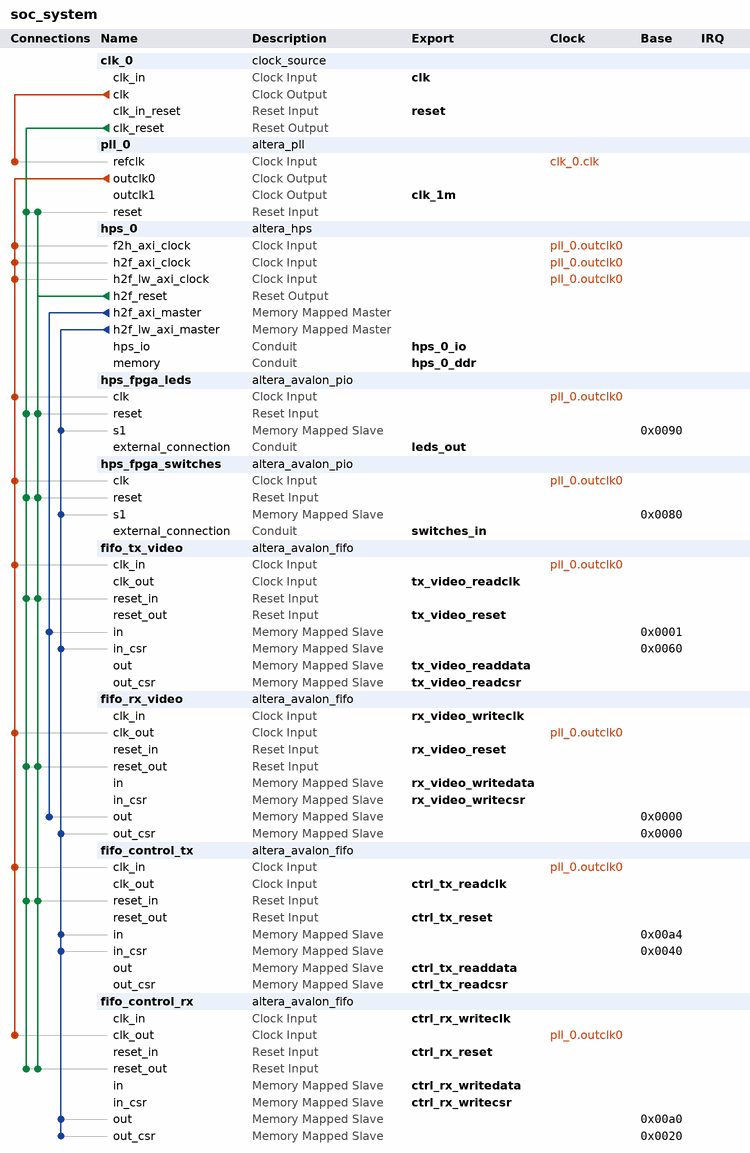
[diagram p0: system contents]
# Platform Designer (Qsys) system soc_system, Cyclone V 5CSEMA5F31C6
# Parameters at their usual value, and those the tool derives, are not listed.
package require -exact qsys 18.1
create_system soc_system
set_project_property DEVICE_FAMILY {Cyclone V}
set_project_property DEVICE 5CSEMA5F31C6

add_instance clk_0 clock_source 18.1
set_instance_parameter_value clk_0 clockFrequency 50000000

add_instance pll_0 altera_pll 18.1
set_instance_parameter_value pll_0 gui_device_speed_grade 2
set_instance_parameter_value pll_0 gui_number_of_clocks 2
set_instance_parameter_value pll_0 gui_operation_mode normal
set_instance_parameter_value pll_0 gui_output_clock_frequency0 50.0
set_instance_parameter_value pll_0 gui_output_clock_frequency1 10.0
set_instance_parameter_value pll_0 gui_pll_mode {Integer-N PLL}
set_instance_parameter_value pll_0 gui_reference_clock_frequency 50.0
set_instance_parameter_value pll_0 gui_use_locked false

add_instance hps_0 altera_hps 18.1
set_instance_parameter_value hps_0 EMAC1_Mode RGMII
set_instance_parameter_value hps_0 EMAC1_PinMuxing {HPS I/O Set 0}
set_instance_parameter_value hps_0 F2SCLK_COLDRST_Enable false
set_instance_parameter_value hps_0 F2SCLK_DBGRST_Enable false
set_instance_parameter_value hps_0 F2SCLK_WARMRST_Enable false
set_instance_parameter_value hps_0 F2SINTERRUPT_Enable false
set_instance_parameter_value hps_0 F2S_Width 2
set_instance_parameter_value hps_0 FPGA_PERIPHERAL_OUTPUT_CLOCK_FREQ_EMAC0_GTX_CLK 125
set_instance_parameter_value hps_0 FPGA_PERIPHERAL_OUTPUT_CLOCK_FREQ_EMAC0_MD_CLK 100.0
set_instance_parameter_value hps_0 FPGA_PERIPHERAL_OUTPUT_CLOCK_FREQ_EMAC1_GTX_CLK 125
set_instance_parameter_value hps_0 FPGA_PERIPHERAL_OUTPUT_CLOCK_FREQ_EMAC1_MD_CLK 100.0
set_instance_parameter_value hps_0 HPS_PROTOCOL DDR3
set_instance_parameter_value hps_0 I2C0_Mode I2C
set_instance_parameter_value hps_0 I2C0_PinMuxing {HPS I/O Set 0}
set_instance_parameter_value hps_0 I2C1_Mode I2C
set_instance_parameter_value hps_0 I2C1_PinMuxing {HPS I/O Set 0}
set_instance_parameter_value hps_0 LWH2F_Enable true
set_instance_parameter_value hps_0 MEM_BANKADDR_WIDTH 3
set_instance_parameter_value hps_0 MEM_CLK_FREQ 400.0
set_instance_parameter_value hps_0 MEM_COL_ADDR_WIDTH 10
set_instance_parameter_value hps_0 MEM_DQ_WIDTH 32
set_instance_parameter_value hps_0 MEM_DRV_STR RZQ/7
set_instance_parameter_value hps_0 MEM_ROW_ADDR_WIDTH 15
set_instance_parameter_value hps_0 MEM_RTT_NOM RZQ/4
set_instance_parameter_value hps_0 MEM_RTT_WR RZQ/4
set_instance_parameter_value hps_0 MEM_TCL 11
set_instance_parameter_value hps_0 MEM_TFAW_NS 30.0
set_instance_parameter_value hps_0 MEM_TRAS_NS 35.0
set_instance_parameter_value hps_0 MEM_TRCD_NS 13.75
set_instance_parameter_value hps_0 MEM_TRFC_NS 260.0
set_instance_parameter_value hps_0 MEM_TRP_NS 13.75
set_instance_parameter_value hps_0 MEM_VENDOR Other
set_instance_parameter_value hps_0 MEM_WTCL 8
set_instance_parameter_value hps_0 QSPI_Mode {1 SS}
set_instance_parameter_value hps_0 QSPI_PinMuxing {HPS I/O Set 0}
set_instance_parameter_value hps_0 REF_CLK_FREQ 25.0
set_instance_parameter_value hps_0 S2FCLK_USER2CLK 5
set_instance_parameter_value hps_0 S2F_Width 2
set_instance_parameter_value hps_0 SDIO_Mode {4-bit Data}
set_instance_parameter_value hps_0 SDIO_PinMuxing {HPS I/O Set 0}
set_instance_parameter_value hps_0 SPIM1_Mode {Single Slave Select}
set_instance_parameter_value hps_0 SPIM1_PinMuxing {HPS I/O Set 0}
set_instance_parameter_value hps_0 STM_Enable false
set_instance_parameter_value hps_0 TIMING_BOARD_AC_SKEW 0.02
set_instance_parameter_value hps_0 TIMING_BOARD_AC_TO_CK_SKEW 0.01
set_instance_parameter_value hps_0 TIMING_BOARD_DQ_TO_DQS_SKEW 0.05
set_instance_parameter_value hps_0 TIMING_BOARD_MAX_CK_DELAY 0.03
set_instance_parameter_value hps_0 TIMING_BOARD_MAX_DQS_DELAY 0.02
set_instance_parameter_value hps_0 TIMING_BOARD_SKEW_BETWEEN_DQS 0.06
set_instance_parameter_value hps_0 TIMING_BOARD_SKEW_CKDQS_DIMM_MAX 0.16
set_instance_parameter_value hps_0 TIMING_BOARD_SKEW_CKDQS_DIMM_MIN 0.06
set_instance_parameter_value hps_0 TIMING_BOARD_SKEW_WITHIN_DQS 0.01
set_instance_parameter_value hps_0 TIMING_TDH 65
set_instance_parameter_value hps_0 TIMING_TDQSCK 255
set_instance_parameter_value hps_0 TIMING_TDQSQ 125
set_instance_parameter_value hps_0 TIMING_TDS 30
set_instance_parameter_value hps_0 TIMING_TIH 140
set_instance_parameter_value hps_0 TIMING_TIS 180
set_instance_parameter_value hps_0 TIMING_TQSH 0.4
set_instance_parameter_value hps_0 UART0_Mode {No Flow Control}
set_instance_parameter_value hps_0 UART0_PinMuxing {HPS I/O Set 0}
set_instance_parameter_value hps_0 USB1_Mode SDR
set_instance_parameter_value hps_0 USB1_PinMuxing {HPS I/O Set 0}
set_instance_parameter_value hps_0 desired_cfg_clk_mhz 100.0
set_instance_parameter_value hps_0 desired_qspi_clk_mhz 400.0

add_instance hps_fpga_leds altera_avalon_pio 18.1
set_instance_parameter_value hps_fpga_leds direction Output
set_instance_parameter_value hps_fpga_leds width 10

add_instance hps_fpga_switches altera_avalon_pio 18.1
set_instance_parameter_value hps_fpga_switches direction Input
set_instance_parameter_value hps_fpga_switches width 10

add_instance fifo_tx_video altera_avalon_fifo 18.1
set_instance_parameter_value fifo_tx_video avalonMMAvalonMMDataWidth 8
set_instance_parameter_value fifo_tx_video bitsPerSymbol 16
set_instance_parameter_value fifo_tx_video channelWidth 8
set_instance_parameter_value fifo_tx_video errorWidth 8
set_instance_parameter_value fifo_tx_video fifoDepth 2048
set_instance_parameter_value fifo_tx_video fifoInputInterfaceOptions AVALONMM_WRITE
set_instance_parameter_value fifo_tx_video fifoOutputInterfaceOptions AVALONMM_READ
set_instance_parameter_value fifo_tx_video singleClockMode false
set_instance_parameter_value fifo_tx_video symbolsPerBeat 2
set_instance_parameter_value fifo_tx_video useBackpressure false
set_instance_parameter_value fifo_tx_video useIRQ false
set_instance_parameter_value fifo_tx_video usePacket true
set_instance_parameter_value fifo_tx_video useReadControl true

add_instance fifo_rx_video altera_avalon_fifo 18.1
set_instance_parameter_value fifo_rx_video avalonMMAvalonMMDataWidth 8
set_instance_parameter_value fifo_rx_video bitsPerSymbol 16
set_instance_parameter_value fifo_rx_video channelWidth 8
set_instance_parameter_value fifo_rx_video errorWidth 8
set_instance_parameter_value fifo_rx_video fifoDepth 2048
set_instance_parameter_value fifo_rx_video fifoInputInterfaceOptions AVALONMM_WRITE
set_instance_parameter_value fifo_rx_video fifoOutputInterfaceOptions AVALONMM_READ
set_instance_parameter_value fifo_rx_video singleClockMode false
set_instance_parameter_value fifo_rx_video symbolsPerBeat 2
set_instance_parameter_value fifo_rx_video useBackpressure false
set_instance_parameter_value fifo_rx_video useIRQ false
set_instance_parameter_value fifo_rx_video usePacket true
set_instance_parameter_value fifo_rx_video useReadControl true

add_instance fifo_control_tx altera_avalon_fifo 18.1
set_instance_parameter_value fifo_control_tx avalonMMAvalonMMDataWidth 8
set_instance_parameter_value fifo_control_tx bitsPerSymbol 16
set_instance_parameter_value fifo_control_tx channelWidth 8
set_instance_parameter_value fifo_control_tx errorWidth 8
set_instance_parameter_value fifo_control_tx fifoDepth 8
set_instance_parameter_value fifo_control_tx fifoInputInterfaceOptions AVALONMM_WRITE
set_instance_parameter_value fifo_control_tx fifoOutputInterfaceOptions AVALONMM_READ
set_instance_parameter_value fifo_control_tx singleClockMode false
set_instance_parameter_value fifo_control_tx symbolsPerBeat 2
set_instance_parameter_value fifo_control_tx useBackpressure false
set_instance_parameter_value fifo_control_tx useIRQ false
set_instance_parameter_value fifo_control_tx usePacket true
set_instance_parameter_value fifo_control_tx useReadControl true

add_instance fifo_control_rx altera_avalon_fifo 18.1
set_instance_parameter_value fifo_control_rx bitsPerSymbol 16
set_instance_parameter_value fifo_control_rx channelWidth 8
set_instance_parameter_value fifo_control_rx errorWidth 8
set_instance_parameter_value fifo_control_rx fifoDepth 8
set_instance_parameter_value fifo_control_rx fifoInputInterfaceOptions AVALONMM_WRITE
set_instance_parameter_value fifo_control_rx fifoOutputInterfaceOptions AVALONMM_READ
set_instance_parameter_value fifo_control_rx singleClockMode false
set_instance_parameter_value fifo_control_rx symbolsPerBeat 2
set_instance_parameter_value fifo_control_rx useBackpressure false
set_instance_parameter_value fifo_control_rx useIRQ false
set_instance_parameter_value fifo_control_rx usePacket true
set_instance_parameter_value fifo_control_rx useReadControl true

# connections
add_connection clk_0.clk pll_0.refclk clock
add_connection pll_0.outclk0 fifo_control_rx.clk_out clock
add_connection pll_0.outclk0 fifo_control_tx.clk_in clock
add_connection pll_0.outclk0 fifo_rx_video.clk_out clock
add_connection pll_0.outclk0 fifo_tx_video.clk_in clock
add_connection pll_0.outclk0 hps_0.f2h_axi_clock clock
add_connection pll_0.outclk0 hps_0.h2f_axi_clock clock
add_connection pll_0.outclk0 hps_0.h2f_lw_axi_clock clock
add_connection pll_0.outclk0 hps_fpga_leds.clk clock
add_connection pll_0.outclk0 hps_fpga_switches.clk clock
add_connection clk_0.clk_reset fifo_control_rx.reset_out reset
add_connection clk_0.clk_reset fifo_control_tx.reset_in reset
add_connection clk_0.clk_reset fifo_rx_video.reset_out reset
add_connection clk_0.clk_reset fifo_tx_video.reset_in reset
add_connection clk_0.clk_reset hps_fpga_leds.reset reset
add_connection clk_0.clk_reset hps_fpga_switches.reset reset
add_connection clk_0.clk_reset pll_0.reset reset
add_connection hps_0.h2f_reset fifo_control_rx.reset_out reset
add_connection hps_0.h2f_reset fifo_control_tx.reset_in reset
add_connection hps_0.h2f_reset fifo_rx_video.reset_out reset
add_connection hps_0.h2f_reset fifo_tx_video.reset_in reset
add_connection hps_0.h2f_reset hps_fpga_leds.reset reset
add_connection hps_0.h2f_reset hps_fpga_switches.reset reset
add_connection hps_0.h2f_reset pll_0.reset reset
add_connection hps_0.h2f_axi_master fifo_rx_video.out avalon
set_connection_parameter_value hps_0.h2f_axi_master/fifo_rx_video.out baseAddress 0x0000
add_connection hps_0.h2f_axi_master fifo_tx_video.in avalon
set_connection_parameter_value hps_0.h2f_axi_master/fifo_tx_video.in baseAddress 0x0001
add_connection hps_0.h2f_lw_axi_master fifo_control_rx.out avalon
set_connection_parameter_value hps_0.h2f_lw_axi_master/fifo_control_rx.out baseAddress 0x00a0
add_connection hps_0.h2f_lw_axi_master fifo_control_rx.out_csr avalon
set_connection_parameter_value hps_0.h2f_lw_axi_master/fifo_control_rx.out_csr baseAddress 0x0020
add_connection hps_0.h2f_lw_axi_master fifo_control_tx.in avalon
set_connection_parameter_value hps_0.h2f_lw_axi_master/fifo_control_tx.in baseAddress 0x00a4
add_connection hps_0.h2f_lw_axi_master fifo_control_tx.in_csr avalon
set_connection_parameter_value hps_0.h2f_lw_axi_master/fifo_control_tx.in_csr baseAddress 0x0040
add_connection hps_0.h2f_lw_axi_master fifo_rx_video.out_csr avalon
set_connection_parameter_value hps_0.h2f_lw_axi_master/fifo_rx_video.out_csr baseAddress 0x0000
add_connection hps_0.h2f_lw_axi_master fifo_tx_video.in_csr avalon
set_connection_parameter_value hps_0.h2f_lw_axi_master/fifo_tx_video.in_csr baseAddress 0x0060
add_connection hps_0.h2f_lw_axi_master hps_fpga_leds.s1 avalon
set_connection_parameter_value hps_0.h2f_lw_axi_master/hps_fpga_leds.s1 baseAddress 0x0090
add_connection hps_0.h2f_lw_axi_master hps_fpga_switches.s1 avalon
set_connection_parameter_value hps_0.h2f_lw_axi_master/hps_fpga_switches.s1 baseAddress 0x0080

# exported interfaces
add_interface clk clock sink
set_interface_property clk EXPORT_OF clk_0.clk_in
add_interface clk_1m clock source
set_interface_property clk_1m EXPORT_OF pll_0.outclk1
add_interface ctrl_rx_reset reset sink
set_interface_property ctrl_rx_reset EXPORT_OF fifo_control_rx.reset_in
add_interface ctrl_rx_writeclk clock sink
set_interface_property ctrl_rx_writeclk EXPORT_OF fifo_control_rx.clk_in
add_interface ctrl_rx_writecsr avalon slave
set_interface_property ctrl_rx_writecsr EXPORT_OF fifo_control_rx.in_csr
add_interface ctrl_rx_writedata avalon slave
set_interface_property ctrl_rx_writedata EXPORT_OF fifo_control_rx.in
add_interface ctrl_tx_readclk clock sink
set_interface_property ctrl_tx_readclk EXPORT_OF fifo_control_tx.clk_out
add_interface ctrl_tx_readcsr avalon slave
set_interface_property ctrl_tx_readcsr EXPORT_OF fifo_control_tx.out_csr
add_interface ctrl_tx_readdata avalon slave
set_interface_property ctrl_tx_readdata EXPORT_OF fifo_control_tx.out
add_interface ctrl_tx_reset reset sink
set_interface_property ctrl_tx_reset EXPORT_OF fifo_control_tx.reset_out
add_interface hps_0_ddr conduit end
set_interface_property hps_0_ddr EXPORT_OF hps_0.memory
add_interface hps_0_io conduit end
set_interface_property hps_0_io EXPORT_OF hps_0.hps_io
add_interface leds_out conduit end
set_interface_property leds_out EXPORT_OF hps_fpga_leds.external_connection
add_interface reset reset sink
set_interface_property reset EXPORT_OF clk_0.clk_in_reset
add_interface rx_video_reset reset sink
set_interface_property rx_video_reset EXPORT_OF fifo_rx_video.reset_in
add_interface rx_video_writeclk clock sink
set_interface_property rx_video_writeclk EXPORT_OF fifo_rx_video.clk_in
add_interface rx_video_writecsr avalon slave
set_interface_property rx_video_writecsr EXPORT_OF fifo_rx_video.in_csr
add_interface rx_video_writedata avalon slave
set_interface_property rx_video_writedata EXPORT_OF fifo_rx_video.in
add_interface switches_in conduit end
set_interface_property switches_in EXPORT_OF hps_fpga_switches.external_connection
add_interface tx_video_readclk clock sink
set_interface_property tx_video_readclk EXPORT_OF fifo_tx_video.clk_out
add_interface tx_video_readcsr avalon slave
set_interface_property tx_video_readcsr EXPORT_OF fifo_tx_video.out_csr
add_interface tx_video_readdata avalon slave
set_interface_property tx_video_readdata EXPORT_OF fifo_tx_video.out
add_interface tx_video_reset reset sink
set_interface_property tx_video_reset EXPORT_OF fifo_tx_video.reset_out

set_interconnect_requirement {$system} qsys_mm.clockCrossingAdapter HANDSHAKE
set_interconnect_requirement {$system} qsys_mm.enableEccProtection FALSE
set_interconnect_requirement {$system} qsys_mm.insertDefaultSlave FALSE
set_interconnect_requirement {$system} qsys_mm.maxAdditionalLatency 1

save_system soc_system.qsys
